# Altium schematic sheet OUTPUT.SchDoc
size A4; SheetNumber: 6; SheetTotal: 6
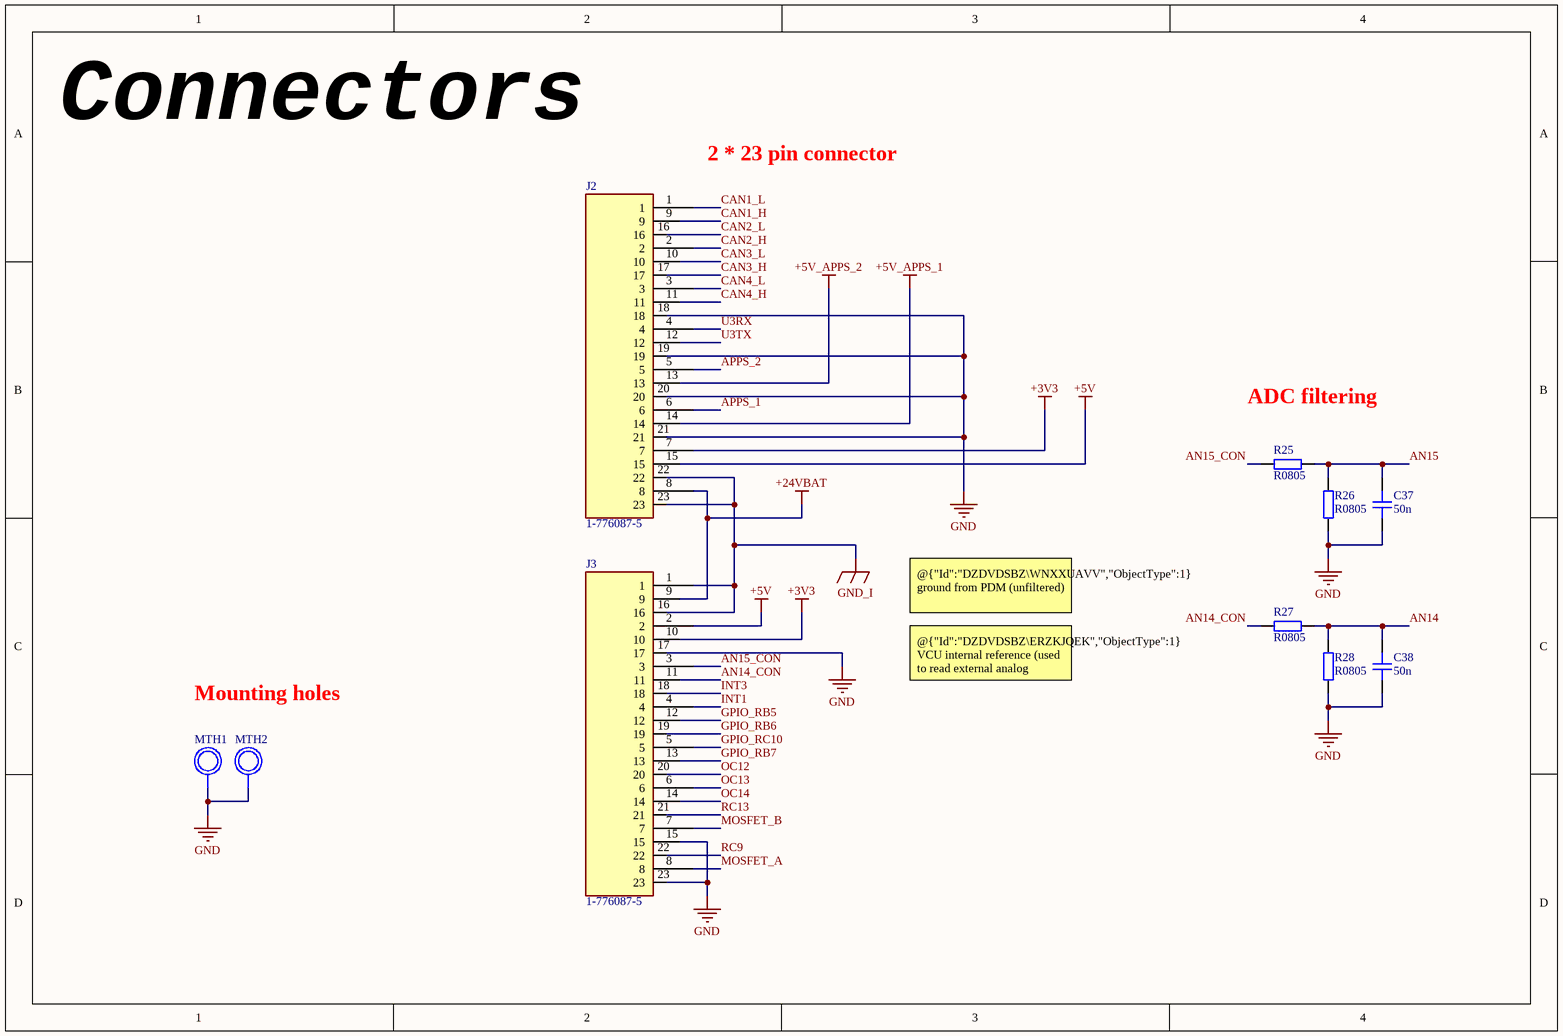
[diagram p0: OUTPUT.SchDoc]

## Parts
C37  50n  [CAP_0805]
C38  50n  [CAP_0805]
J2  1-776087-5  [1-776087-5]
J3  1-776087-5  [1-776087-5]
MTH1  Mounting_Hole_3.5mm  [Mounting_Hole_3.5mm]  (value not drawn)
MTH2  Mounting_Hole_3.5mm  [Mounting_Hole_3.5mm]  (value not drawn)
R25  R0805  [RES_0805]
R26  R0805  [RES_0805]
R27  R0805  [RES_0805]
R28  R0805  [RES_0805]

## Nets
+3V3: J2.7 J3.10
+5V: J2.15 J3.2
+5V_APPS_1: J2.14
+5V_APPS_2: J2.13
+24VBAT: J2.8 J3.9
GND: C37.2 C38.2 J2.18 J2.19 J2.20 J2.21 J3.15 J3.17 J3.23 MTH1.1 MTH2.1 R26.2 R28.2
GND_I: J2.22 J2.23 J3.1 J3.16
AN14: C38.1 R27.1 R28.1
AN14_CON: J3.11 R27.2
AN15: C37.1 R25.1 R26.1
AN15_CON: J3.3 R25.2
APPS_1: J2.6
APPS_2: J2.5
CAN1_H: J2.9
CAN1_L: J2.1
CAN2_H: J2.2
CAN2_L: J2.16
CAN3_H: J2.17
CAN3_L: J2.10
CAN4_H: J2.11
CAN4_L: J2.3
GPIO_RB5: J3.12
GPIO_RB6: J3.19
GPIO_RB7: J3.13
GPIO_RC10: J3.5
INT1: J3.4
INT3: J3.18
MOSFET_A: J3.8
MOSFET_B: J3.7
OC12: J3.20
OC13: J3.6
OC14: J3.14
RC9: J3.22
RC13: J3.21
U3RX: J2.4
U3TX: J2.12

## Notes on the sheet
- Connectors
- 2 * 23 pin connector
- ADC filtering
- @{"Id":"DZDVDSBZ\WNXXUAVV","ObjectType":1} ground from PDM (unfiltered)
- Mounting holes
- @{"Id":"DZDVDSBZ\ERZKJQEK","ObjectType":1} VCU internal reference (used to read external analog sensores)

## Library data of the parts
C37 C38 = CAP_0805_10V: Capacitor SMD 0805 10V
J2 J3 = 1-776087-5: CONN HDR 23POS R/A W/GASKET AU
R25-R28 = RES_0805: Resistor SMD 0805; Manufacturer: *; Manufacturer Part Number: *; Distributor Link: *; LCSC: *